# Altium schematic sheet 300mV FVD schottky diode.schdoc
size 127 x 101 mm
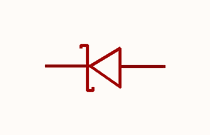
[diagram p0: 300mV FVD schottky diode.schdoc]

## Parts
D?  MBR120VLSFT1G  [SOD-123F_L2.8-W1.8-LS3.7-RD]  (value not drawn)

## Nets

Not connected (* = marked no-connect by the designer): D? 1(K) 2(A)

## Library data of the parts
D? = MBR120VLSFT1G: Manufacturer: onsemi(安森美); Add into BOM: yes; Forward Voltage (Vf@If): 300mV@1A; Reverse Voltage (Vr): 20V; Average Rectified Current (Io): 1A; Reverse Leakage Current (Ir): 600uA@20V; Symbol: MBR120VLSFT1G; Device: MBR120VLSFT1G; LCSC Part Name: 电压:20V 电流:1A; Supplier Part: C223608; Manufacturer Part: MBR120VLSFT1G; Supplier Footprint: SOD-123FL; JLCPCB Part Class: Extended Part; Datasheet: https://atta.szlcsc.com/upload/public/pdf/source/20221020/29D26ECD33A75D76A8E47ED9553F3BCF.pdf; Supplier: LCSC; Convert to PCB: yes